# EAGLE design SNES-1Chip_MR_QID (EAGLE 7.5.0)
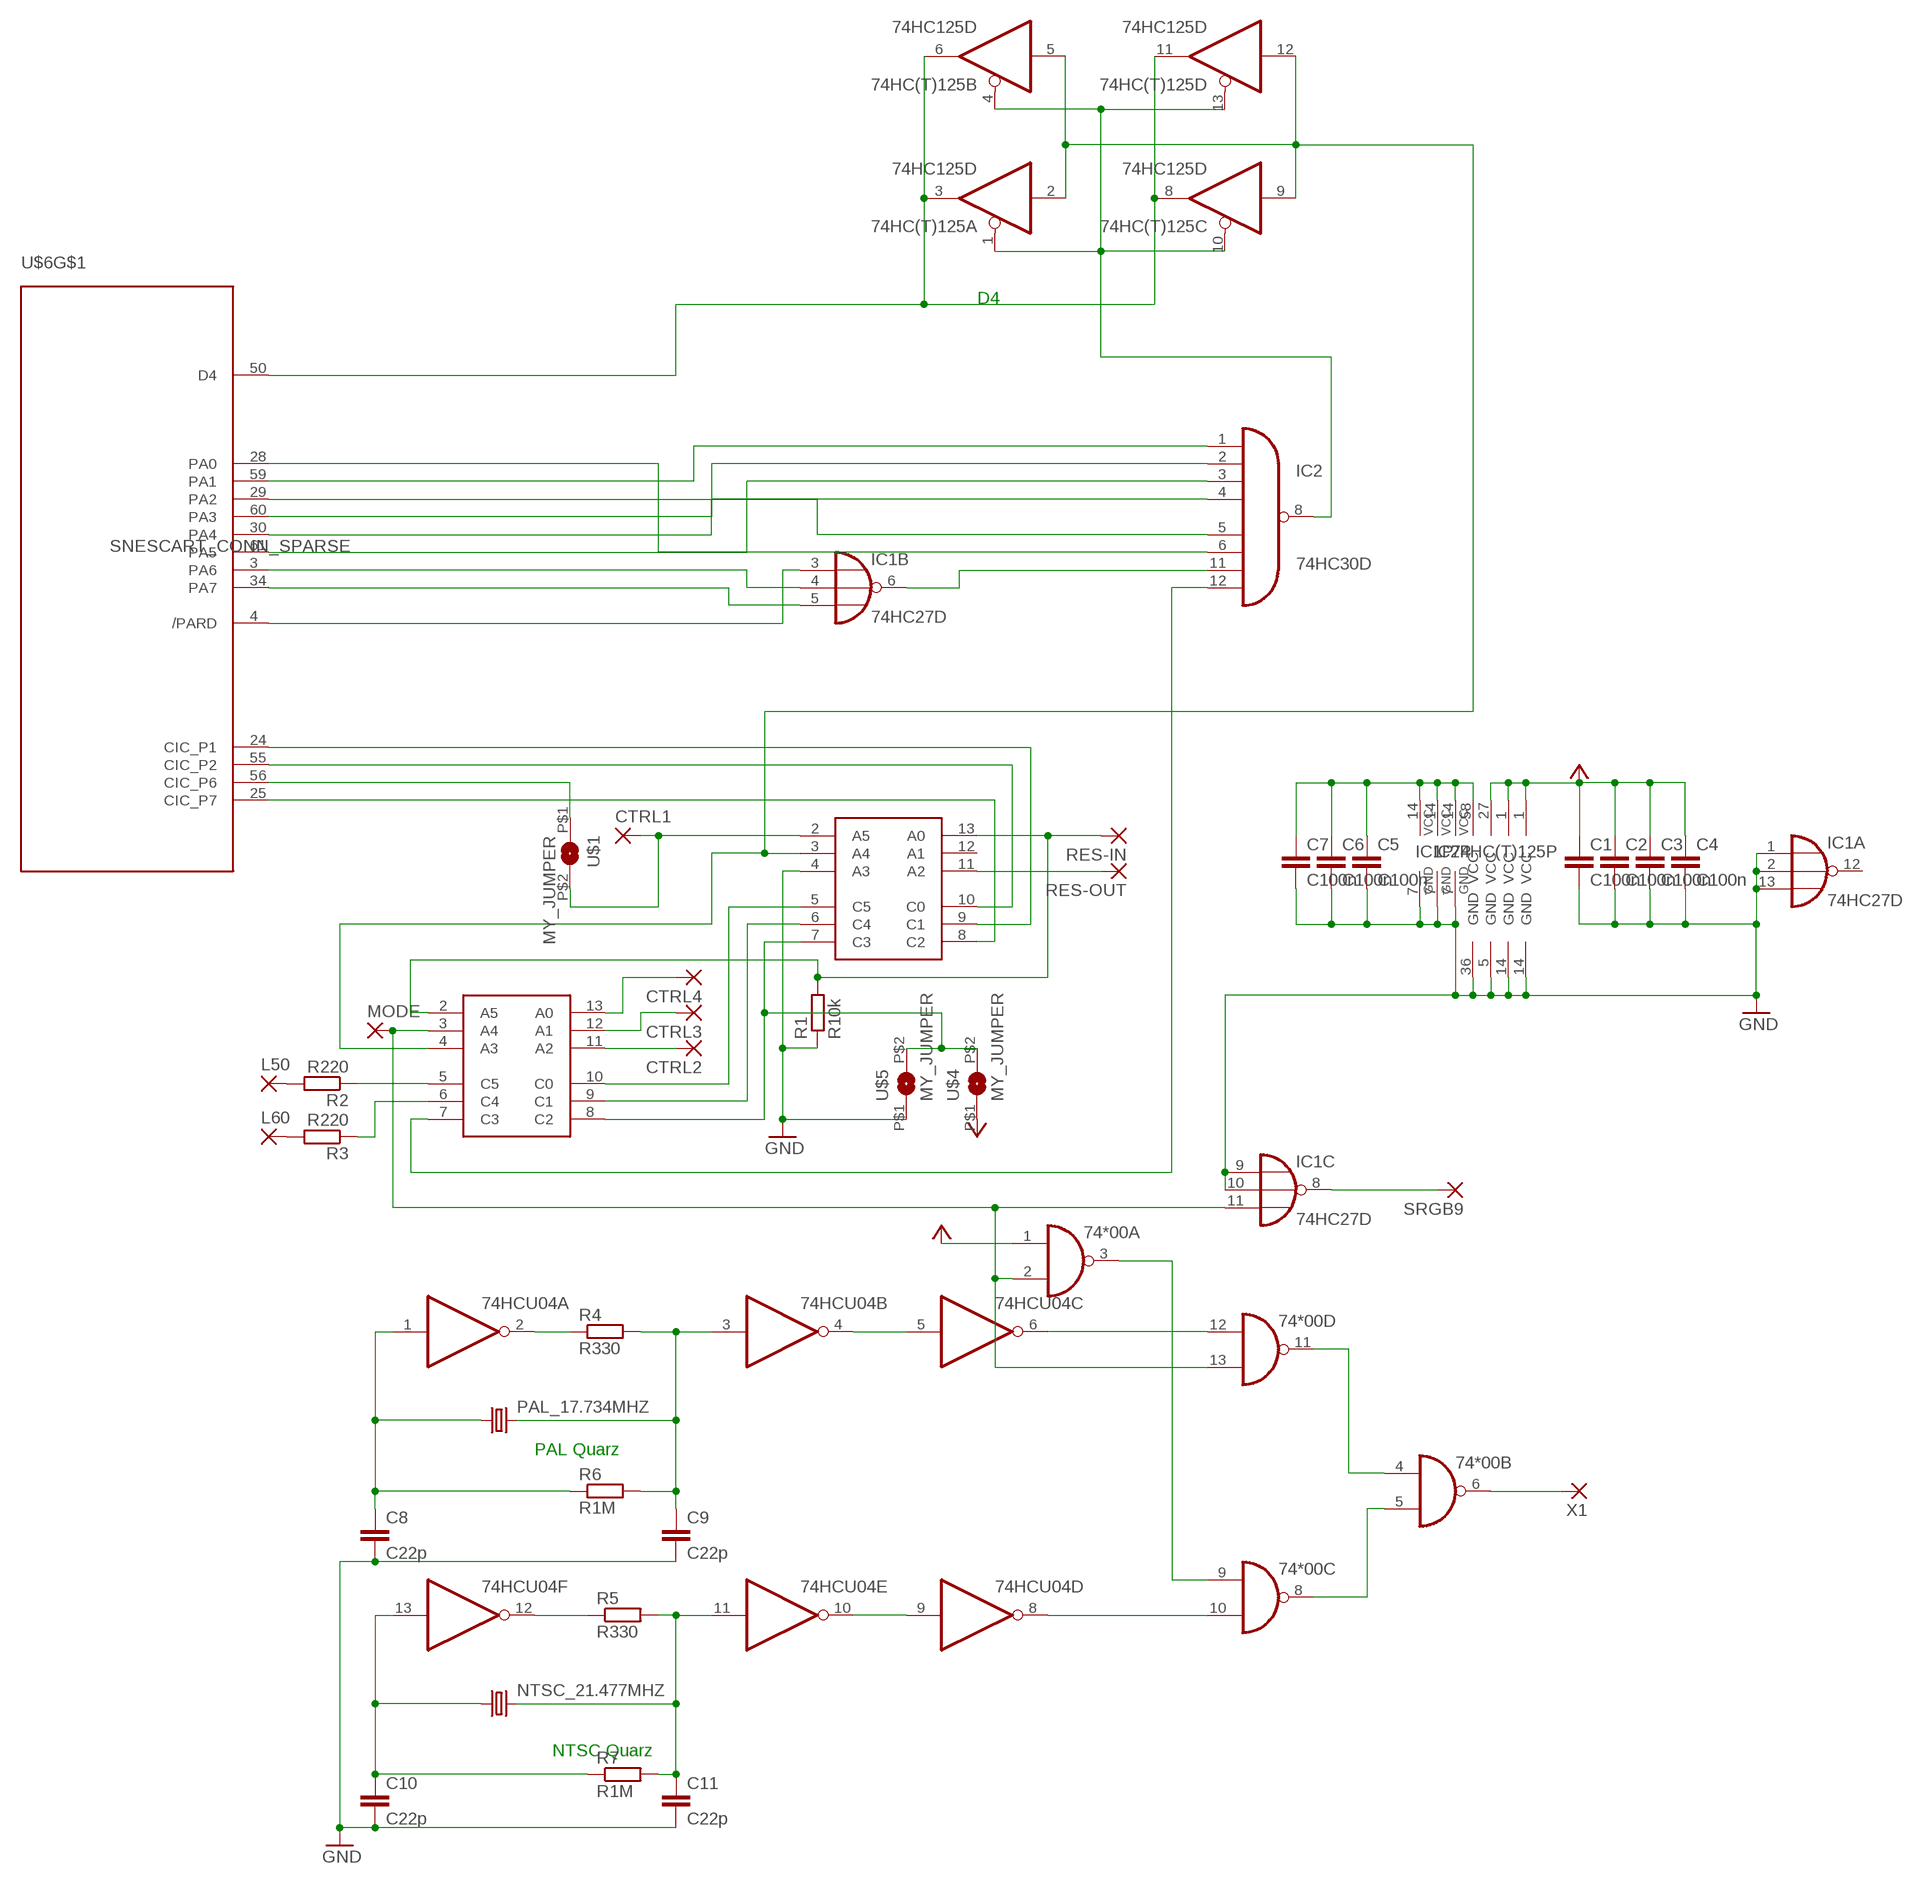
[diagram p0: schematic, sheet 1]

## Parts
74*00  7400D  [SO14]
74HC(T)125  74HC125D  [SO14]
74HCU04  74HC04D  [SO14]
C1  C100n  C0805  [Z0805]
C2  C100n  C0805  [Z0805]
C3  C100n  C0805  [Z0805]
C4  C100n  C0805  [Z0805]
C5  C100n  C0805  [Z0805]
C6  C100n  C0805  [Z0805]
C7  C100n  C0805  [Z0805]
C8  C22p  C0805  [Z0805]
C9  C22p  C0805  [Z0805]
C10  C22p  C0805  [Z0805]
C11  C22p  C0805  [Z0805]
CTRL1  SMD2  [SMD1,27-2,54]
CTRL2  SMD2  [SMD1,27-2,54]
CTRL3  SMD2  [SMD1,27-2,54]
CTRL4  SMD2  [SMD1,27-2,54]
IC1  74HC27D  [SO14]
IC2  74HC30D  [SO14]
L50  SMD2  [SMD1,27-2,54]
L60  SMD2  [SMD1,27-2,54]
MODE  SMD2  [SMD1,27-2,54]
NTSC_21.477MHZ  CRYSTALHC49UP  [HC49UP]
PAL_17.734MHZ  CRYSTALHC49UP  [HC49UP]
R1  R10k  R0805  [Z0805]
R2  R220  R0805  [Z0805]
R3  R220  R0805  [Z0805]
R4  R330  R0805  [Z0805]
R5  R330  R0805  [Z0805]
R6  R1M  R0805  [Z0805]
R7  R1M  R0805  [Z0805]
RES-IN  SMD2  [SMD1,27-2,54]
RES-OUT  SMD2  [SMD1,27-2,54]
SRGB9  SMD2  [SMD1,27-2,54]
U$1  MY_JUMPER  [MYJUMP]
U$2  PIC16F630_SIMPLE  [PIC16F630]
U$3  PIC16F630_SIMPLE  [PIC16F630]
U$4  MY_JUMPER  [MYJUMP]
U$5  MY_JUMPER  [MYJUMP]
U$6  SNESCART_CONN_SPARSE  [SNESCART_CONN_SPARSE]
X1  SMD2  [SMD1,27-2,54]

## Nets
GND: 74HC(T)125.7(P:GND) C1.2 C2.2 C3.2 C4.2 C5.2 C6.2 C7.2 C8.2 C9.2 C10.2 C11.2 IC1.1(A:I0) IC1.2(A:I1) IC1.7(P:GND) IC1.9(C:I0) IC1.10(C:I1) IC1.13(A:I2) IC2.7(GND) R1.1 U$2.4(A3) U$2.14(GND) U$3.14(GND) U$5.P$1 U$6.5(GND) U$6.36(GND)
N$1: IC1.8(C:O) SRGB9.1(P)
N$2: 74HC(T)125.1(A:OE) 74HC(T)125.4(B:OE) 74HC(T)125.10(C:OE) 74HC(T)125.13(D:OE) IC2.8(O)
N$3: RES-OUT.1(P) U$2.11(A2)
N$4: IC2.3(I2) U$6.61(PA5)
N$5: IC2.2(I1) U$6.60(PA3)
N$6: IC1.3(B:I0) U$6.4(/PARD)
N$7: IC1.4(B:I1) U$6.3(PA6)
N$8: IC1.6(B:O) IC2.11(I6)
N$9: IC2.6(I5) U$6.28(PA0)
N$10: R1.2 RES-IN.1(P) U$2.13(A0) U$3.2(A5)
N$11: L50.1(P) R2.2
N$12: R2.1 U$3.5(C5)
N$13: R3.1 U$3.6(C4)
N$14: 74*00.2(A:I1) 74*00.13(D:I1) IC1.11(C:I2) MODE.1(P) U$3.3(A4)
N$15: L60.1(P) R3.2
N$16: IC1.5(B:I2) U$6.34(PA7)
N$17: IC2.12(I7) U$3.7(C3)
N$18: U$1.P$1 U$6.56(CIC_P6)
N$19: U$2.5(C5) U$3.10(C0)
N$20: IC2.1(I0) U$6.59(PA1)
N$21: IC2.5(I4) U$6.29(PA2)
N$22: IC2.4(I3) U$6.30(PA4)
N$26: 74*00.12(D:I0) 74HCU04.6(C:O)
N$27: 74HCU04.1(A:I) C8.1 PAL_17.734MHZ.1 R6.1
N$28: 74HCU04.3(B:I) C9.1 PAL_17.734MHZ.2 R4.2 R6.2
N$29: 74HCU04.13(F:I) C10.1 NTSC_21.477MHZ.1 R7.1
N$30: 74HCU04.11(E:I) C11.1 NTSC_21.477MHZ.2 R5.2 R7.2
N$31: 74*00.5(B:I1) 74*00.8(C:O)
N$32: 74*00.4(B:I0) 74*00.11(D:O)
N$33: CTRL2.1(P) U$3.11(A2)
N$34: CTRL3.1(P) U$3.12(A1)
N$35: 74*00.3(A:O) 74*00.9(C:I0)
N$36: 74*00.6(B:O) X1.1(P)
N$37: 74HCU04.2(A:O) R4.1
N$38: 74HCU04.4(B:O) 74HCU04.5(C:I)
N$39: CTRL1.1(P) U$1.P$2 U$2.2(A5)
N$41: 74*00.10(C:I1) 74HCU04.8(D:O)
N$42: 74HC(T)125.3(A:O) 74HC(T)125.6(B:O) 74HC(T)125.8(C:O) 74HC(T)125.11(D:O) U$6.50(D4)
N$44: 74HCU04.9(D:I) 74HCU04.10(E:O)
N$46: CTRL4.1(P) U$3.13(A0)
N$48: U$2.10(C0) U$6.55(CIC_P2)
N$49: U$2.9(C1) U$6.24(CIC_P1)
N$50: 74HCU04.12(F:O) R5.1
N$51: U$2.8(C2) U$6.25(CIC_P7)
N$52: U$2.6(C4) U$3.9(C1)
N$53: U$2.7(C3) U$3.8(C2) U$4.P$2 U$5.P$2
UIGR: 74HC(T)125.2(A:I) 74HC(T)125.5(B:I) 74HC(T)125.9(C:I) 74HC(T)125.12(D:I) U$2.3(A4) U$3.4(A3)
VCC: 74*00.1(A:I0) C1.1 C2.1 C3.1 C4.1 U$2.1(VCC) U$3.1(VCC) U$4.P$1 U$6.27(VCC)
VCC_2: 74HC(T)125.14(P:VCC) C5.1 C6.1 C7.1 IC1.14(P:VCC) IC2.14(VCC) U$6.58(VCC)
Unconnected: IC1.12(A:O) U$2.12(A1)

## Notes on the sheet
- D4
- PAL Quarz
- NTSC Quarz

## Power pins joined to a net without a drawn wire
GND: 74*00.7(P:GND) 74HCU04.7(P:GND)
VCC: 74*00.14(P:VCC) 74HCU04.14(P:VCC)

## Library data of the parts
74*00 = 74xx-eu:74*00: Quad 2-input NAND gate
74HC(T)125 = 74xx-eu:74*125: Quad bus BUFFER, 3-state
74HCU04 = 74xx-eu:74*04: Hex INVERTER
C1-C11 = snescart:C0805
CTRL1-CTRL4 L50 L60 MODE RES-IN RES-OUT SRGB9 X1 = wirepad:SMD2: SMD PAD
IC1 = 74xx-eu:74*27: Triple 3-input NOR gate
IC2 = 74xx-eu:74*30: 8-input NAND gate
NTSC_21.477MHZ PAL_17.734MHZ = crystal:CRYSTAL: CRYSTAL; OC_FARNELL: unknown; OC_NEWARK: unknown
R1-R7 = snescart:R0805
U$1 U$4 U$5 = snescart:MY_JUMPER
U$2 U$3 = snescart:PIC16F630_SIMPLE
U$6 = snes_div:SNESCART_CONN_SPARSE

## Board
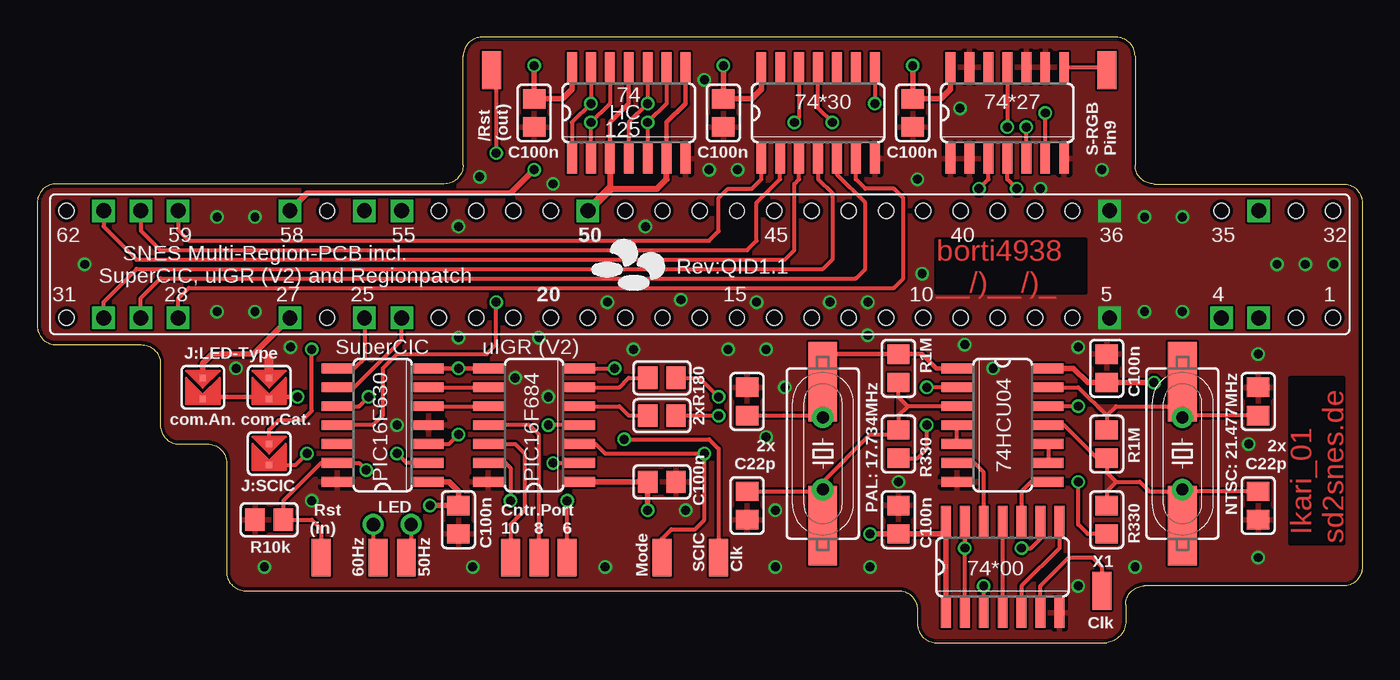
[diagram p1: board, top side]
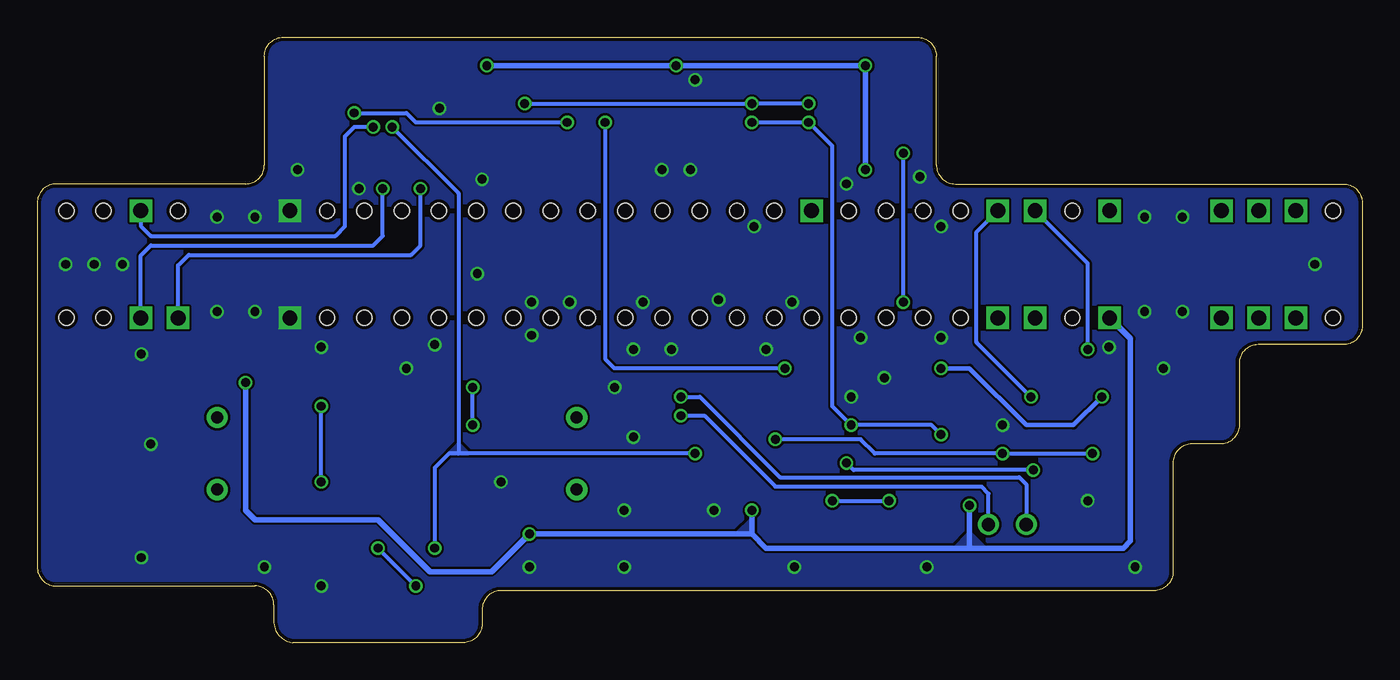
[diagram p2: board, bottom side, seen from below]

Size 88.9 x 40.64 mm. Coordinates in mm from the lower left corner, seen from the top.
Outline: 74.93,30.8 arc-90 73.66,32.07 73.66,39.37 arc90 72.39,40.64 29.84,40.64 arc90 28.57,39.37 28.57,32.07 arc-90 27.3,30.8 1.27,30.8 arc90 0,29.53 0,21.27 arc90 1.27,20 6.99,20 arc-90 8.26,18.73 8.26,14.61 arc90 9.53,13.34 11.43,13.34 arc-90 12.7,12.07 12.7,4.76 arc90 13.97,3.49 57.78,3.49 arc-90 59.05,2.22 59.05,1.27 arc90 60.32,0 71.76,0 arc90 73.03,1.59 73.03,2.54 arc-90 74.3,3.81 87.63,3.81 arc90 88.9,5.08 88.9,29.53 arc90 87.63,30.8 74.93,30.8
Copper layers (1*16): Top 0.035mm / dielectric 1.5mm / Bottom 0.035mm
Design rules "ITEADstudio_DRC": minimum track width 6mil, minimum drill 12mil, track to track 6mil, track to pad 6mil, pad to pad 6mil, via to via 6mil, smd to smd 0mil, copper to edge 10mil, drill to drill 10mil, minimum pad ring 10mil, minimum via ring 6mil, stop-mask expansion 2mil, vias tented up to drill 30mil, thermal gap 10mil
tRestrict: 3 lines

### Footprints (pad centres in the part's own frame; a part is rotated, then mirrored left to right if it is on the bottom)
SO14 = smd 0.66 x 2.032: 1 -3.81,-3.073; 2 -2.54,-3.073; 3 -1.27,-3.073; 4 0,-3.073; 5 1.27,-3.073; 6 2.54,-3.073; 7 3.81,-3.073; 8 3.81,3.073; 9 2.54,3.073; 10 1.27,3.073; 11 0,3.073; 12 -1.27,3.073; 13 -2.54,3.073; 14 -3.81,3.073
Z0805 = smd 1.3 x 1.5: 1 -0.95,0; 2 0.95,0
SMD1,27-2,54 = smd 1.27 x 2.54: 1 0,0
HC49UP = smd 5.334 x 1.93: 1 -4.826,0; 2 4.826,0
MYJUMP = smd 0.406 x 0.406: P$1 -0.635,0; P$2 0.765,0
PIC16F630 = smd 0.66 x 2.032: 1 -3.81,-3.073; 2 -2.54,-3.073; 3 -1.27,-3.073; 4 0,-3.073; 5 1.27,-3.073; 6 2.54,-3.073; 7 3.81,-3.073; 8 3.81,3.073; 9 2.54,3.073; 10 1.27,3.073; 11 0,3.073; 12 -1.27,3.073; 13 -2.54,3.073; 14 -3.81,3.073
SNESCART_CONN_SPARSE = drill 1 square: 3 -3.6,-37.5; 4 -3.6,-35; 5 -3.6,-27.5; 24 -3.6,20; 25 -3.6,22.5; 27 -3.6,27.5; 28 -3.6,35; 29 -3.6,37.5; 30 -3.6,40; 34 3.6,-37.5; 36 3.6,-27.5; 50 3.6,7.5; 55 3.6,20; 56 3.6,22.5; 58 3.6,27.5; 59 3.6,35; 60 3.6,37.5; 61 3.6,40 | hole 1: -3.6,-42.5; -3.6,-40; -3.6,-25; -3.6,-22.5; -3.6,-20; -3.6,-17.5; -3.6,-15; -3.6,-12.5; -3.6,-10; -3.6,-7.5; -3.6,-5; -3.6,-2.5; -3.6,0; -3.6,2.5; -3.6,5; -3.6,7.5; -3.6,10; -3.6,12.5; -3.6,15; -3.6,17.5; -3.6,25; -3.6,42.5; 3.6,42.5; 3.6,25; 3.6,17.5; 3.6,15; 3.6,12.5; 3.6,10; 3.6,5; 3.6,2.5; 3.6,0; 3.6,-2.5; 3.6,-5; 3.6,-7.5; 3.6,-10; 3.6,-12.5; 3.6,-15; 3.6,-17.5; 3.6,-20; 3.6,-22.5; 3.6,-25; 3.6,-35; 3.6,-40; 3.6,-42.5

### Placement (x,y rotation side)
74*00  64.77,5.08 0 top
74HC(T)125  39.69,35.56 0 top
74HCU04  64.77,14.61 270 top
C1  41.91,10.8 0 top
C2  28.26,8.25 270 top
C3  57.78,8.25 90 top
C4  71.76,18.41 90 top
C5  33.34,35.56 270 top
C6  46.04,35.56 270 top
C7  58.74,35.56 270 top
C8  47.62,16.19 90 top
C9  47.62,9.21 270 top
C10  81.92,16.19 90 top
C11  81.92,9.21 270 top
CTRL1  45.72,5.72 0 top
CTRL2  33.65,5.72 0 top
CTRL3  31.75,5.72 0 top
CTRL4  35.56,5.72 0 top
IC1  65.09,35.56 0 top
IC2  52.39,35.56 0 top
L50  24.77,5.72 0 top
L60  22.86,5.72 0 top
MODE  41.91,5.72 0 top
NTSC_21.477MHZ  76.84,12.7 270 top
PAL_17.734MHZ  52.7,12.7 270 top
R1  15.56,8.25 0 top
R2  41.91,15.24 0 top
R3  41.91,17.78 0 top
R4  57.78,13.34 90 top
R5  71.76,8.25 90 top
R6  57.78,18.41 270 top
R7  71.76,13.34 270 top
RES-IN  19.05,5.72 0 top
RES-OUT  30.48,38.42 180 top
SRGB9  71.76,38.42 0 top
U$1  15.56,12.7 270 top
U$2  23.18,14.61 90 top
U$3  33.34,14.61 90 top
U$4  11.11,17.14 270 top
U$5  15.56,17.14 270 top
U$6  44.45,25.4 90 top
X1  71.44,3.49 180 top

### Tracks (layer width: path | path; a pad name or v marks a point on that pad's centre or on a via)
GND  (via drill 0.6)
  Top 0.61: U$5.P$1 15.56,19.05
  other vias: 24.13,14.61 83.19,25.4 87,25.4 49.53,5.08 55.72,22.86 76.84,22.23 71.44,31.75 73.66,5.08 34.61,30.8 3.18,25.4 81.92,5.72 46.35,19.69 74.3,22.23 85.09,25.4 45.08,31.75 81.28,13.34 13.34,18.41 12.07,28.57 81.92,19.37 15.24,5.08 12.07,22.23 14.61,28.57 28.26,27.94 59.05,31.12 40,19.69 74.3,28.57 43.18,23.02 50.16,17.14 34.29,16.51 32.07,17.78 57.78,10.8 46.99,31.75 55.88,5.08 62.23,20 64.14,18.41 55.72,20.64 69.85,19.84 16.99,19.84 38.1,5.08 76.84,28.57 14.61,22.23 48.89,19.69 59.37,24.77 43.5,8.89 67.31,30.48 61.91,35.88 44.77,37.78 53.18,22.86 48.26,22.86 18.41,9.52 29.21,5.08 69.85,3.81 29.69,31.27 38.26,22.86 40.8,27.94 28.26,20.48 33.65,20.48 48.89,13.81 49.53,8.89
  pour Top (rank 2): -1.27,-2.54 90.17,-2.54 90.17,43.18 -1.27,43.18
  pour Bottom (rank 2): -1.27,43.18 90.17,43.18 90.17,-2.54 -1.27,-2.54
  pour Bottom (rank 2, no thermals): 69.85,30.48 73.66,30.48 73.66,20.48 69.85,20.48
  pour Top (rank 2, no thermals): 69.85,30.48 73.66,30.48 73.66,20.64 69.85,20.64
N$1
  Top 0.254: IC1.8 71.22,38.63 SRGB9.1
N$2  (via drill 0.6)
  Top 0.254: 74HC(T)125.13 v37.15,36.2 35.88,34.93 74HC(T)125.1 | 74HC(T)125.10 v40.96,36.2 39.69,34.93 74HC(T)125.4 | IC2.8 v56.2,36.2
  Bottom 0.254: v37.15,36.2 v40.96,36.2 v56.2,36.2
N$3  (via drill 0.6)
  Top 0.254: v30.8,22.86 30.8,20 30.16,19.37 24.13,19.37 23.18,18.41 23.18,15.24 22.54,14.61 U$2.11 | RES-OUT.1 30.8,38.1 v30.8,32.86
  Bottom 0.254: v30.8,22.86 v30.8,32.86
N$4
  Top 0.254: U$6.61 4.45,27.94 6.67,25.72 50.16,25.72 50.8,26.35 50.8,30.8 51.12,31.12 IC2.3
  Top 0.305: U$6.61
N$5
  Top 0.254: U$6.60 6.95,27.66 8.26,26.35 47.62,26.35 48.26,26.99 48.26,29.53 49.85,31.12 IC2.2
N$6  (via drill 0.6)
  Top 0.254: v63.18,30.48 63.82,31.12 IC1.3
  Bottom 0.254: U$6.4 79.45,25.32 78.74,26.04 63.82,26.04 63.18,26.67 v63.18,30.48
N$7  (via drill 0.6)
  Top 0.254: v65.72,30.48 65.09,31.12 IC1.4
  Bottom 0.254: U$6.3 81.95,26 81.28,26.67 66.36,26.67 65.72,27.3 v65.72,30.48
N$8  (via drill 0.6)
  Top 0.254: v53.34,34.93 52.39,35.88 IC2.11 | IC1.6 v67.63,35.56
  Bottom 0.254: v67.63,35.56 64.14,35.56 63.5,34.93 v53.34,34.93
N$9
  Top 0.254: U$6.28 9.45,23.1 10.16,23.81 57.47,23.81 58.1,24.45 58.1,29.84 57.47,30.48 55.56,30.48 54.93,31.12 IC2.6
N$10  (via drill 0.6)
  Top 0.254: RES-IN.1 19.05,7.62 18.41,8.25 R1.2 16.51,9.52 19.05,12.07 U$2.13 21.59,12.07 v22.07,11.59 | v34.61,12.07 U$3.2
  Bottom 0.254: v22.07,11.59 34.13,11.59 v34.61,12.07
N$11  (via drill 0.6, 0.9 pad 1.42)
  Top 0.254: R2.2 v45.72,15.24 | v25.08,7.94 25.08,6.03 L50.1
  Bottom 0.254: v45.72,15.24 44.13,15.24 39.37,10.48 25.56,10.48 25.08,10 v25.08,7.94
N$12
  Top 0.254: U$3.5 39.05,15.88 39.69,15.24 R2.1
N$13
  Top 0.254: U$3.6 39.05,17.14 39.69,17.78 R3.1
N$14  (via drill 0.6)
  Top 0.254: 74*00.2 74*00.13 v62.23,6.35 | U$3.3 37.46,13.34 38.1,12.7 v44.77,12.7 44.77,8.25 44.13,7.62 42.54,7.62 41.91,6.99 MODE.1 | IC1.11 v65.09,34.61
  Bottom 0.254: v44.77,12.7 60.64,12.7 | v65.09,34.61 60.64,30.16 60.64,12.7 | 60.64,12.7 61.28,12.7 62.23,11.75 v62.23,6.35
  pour Bottom: 61.28,12.7 60.01,12.7 60.64,13.34
N$15  (via drill 0.6, 0.9 pad 1.42)
  Top 0.254: R3.2 44.45,17.78 v45.72,16.51 | v22.54,7.94 22.54,6.03 L60.1
  Bottom 0.254: v45.72,16.51 44.45,16.51 39.05,11.11 23.02,11.11 22.54,10.64 v22.54,7.94
N$16  (via drill 0.6)
  Top 0.254: IC1.5 v66.36,34.61
  Bottom 0.254: v66.36,34.61 67.63,34.61 68.26,33.97 68.26,27.94 68.9,27.3 81.28,27.3 81.95,27.98 U$6.34
N$17  (via drill 0.6)
  Top 0.254: U$3.7 v38.73,18.41 | IC2.12 51.12,35.24 v50.8,34.93
  Bottom 0.254: v38.73,18.41 50.16,18.41 50.8,19.05 v50.8,34.93
N$18  (via drill 0.6)
  Top 0.254: U$1.P$1 15.56,14.29 16.19,14.92 17.78,14.92 18.41,15.56 v18.41,19.69
  Bottom 0.254: v18.41,19.69 18.41,25.46 U$6.56
N$19
  Top 0.254: U$2.5 U$3.10
N$20
  Top 0.254: U$6.59 9.45,27.7 10.16,26.99 45.08,26.99 45.72,27.62 45.72,29.84 46.35,30.48 47.94,30.48 48.58,31.12 IC2.1
N$21
  Top 0.254: U$6.29 6.95,23.14 8.26,24.45 54.93,24.45 55.56,25.08 55.56,29.53 53.66,31.43 IC2.5
N$22
  Top 0.254: U$6.30 4.45,22.87 6.67,25.08 52.7,25.08 53.34,25.72 53.34,30.16 52.39,31.12 IC2.4
N$26
  Top 0.254: 74*00.12 63.5,11.43 62.87,12.07 74HCU04.6
N$27  (via drill 0.8 pad 1.42)
  Top 0.254: PAL_17.734MHZ.1 v52.7,15.12 52.7,15.24 C8.1
  Top 0.305: 74HCU04.1 60.32,18.41 59.37,19.37 R6.1 52.71,19.37 52.7,19.37 PAL_17.734MHZ.1
N$28  (via drill 0.8 pad 1.42)
  Top 0.254: 74HCU04.3 58.42,15.88 | 58.42,15.88 57.78,16.51 R6.2 | 58.42,15.88 57.78,15.24 R4.2 57.47,13.97 55.88,13.97 52.7,10.8 v52.7,10.28 52.7,10.16 | C9.1 52.7,10.16 | 52.7,10.16 PAL_17.734MHZ.2
  pour Top: 57.78,15.24 57.78,16.51 58.42,15.88
N$29  (via drill 0.8 pad 1.42)
  Top 0.254: 74HCU04.13 69.85,17.14 71.76,15.24 | 71.76,15.24 R7.1 | 71.76,15.24 72.39,15.88 76.84,15.88 | NTSC_21.477MHZ.1 76.84,15.88 | 76.84,15.88 v76.84,15.12 76.84,15.24 C10.1
  pour Top: 72.39,15.88 71.12,15.88 71.76,15.24
N$30  (via drill 0.8 pad 1.42)
  Top 0.254: 72.39,10.8 71.76,11.43 R7.2 71.12,12.38 68.9,14.61 74HCU04.11 | 72.39,10.8 71.76,10.16 R5.2 | 77.47,10.16 76.83,10.16 74.61,10.16 73.98,10.8 72.39,10.8 | NTSC_21.477MHZ.2 76.84,9.52 77.47,10.16 | C11.1 77.47,10.16 | v76.84,10.28 77.47,10.16
  pour Top: 71.76,10.16 71.76,11.43 72.39,10.8
N$31
  Top 0.254: 74*00.8 68.58,6.35 66.04,3.81 74*00.5
N$32
  Top 0.254: 74*00.11 74*00.4
N$33
  Top 0.254: CTRL2.1 33.65,13.97 33.02,14.61 U$3.11
N$34
  Top 0.254: U$3.12 32.07,13.34 32.7,12.7 32.7,8.89 31.75,7.94 CTRL3.1
N$35  (via drill 0.6)
  Top 0.254: 74*00.3 v63.5,3.81 | v66.04,6.35 66.67,6.35 67.31,6.99 74*00.9
  Bottom 0.254: v63.5,3.81 v66.04,6.35
N$36
  Top 0.254: 74*00.6 67.31,3.81 69.22,5.72 70.8,5.72 71.44,5.08 X1.1
N$37  (via drill 0.6)
  Top 0.254: R4.1 59.06,12.39 59.69,13.02 v59.69,14.61 | 74HCU04.2 v59.69,17.14
  Bottom 0.254: v59.69,14.61 v59.69,17.14
N$38
  Top 0.254: 74HCU04.5 74HCU04.4
N$39  (via drill 0.6)
  Top 0.254: U$2.2 24.77,12.07 v24.13,12.7 | U$1.P$2 17.33,11.93 v18.1,12.7 | v39.37,13.65 45.08,13.65 45.72,13.02 CTRL1.1
  Bottom 0.254: v18.1,12.7 v24.13,12.7 32.7,12.7 33.65,13.65 v39.37,13.65
N$41
  Top 0.254: 74*00.10 66.04,10.16 66.67,10.8 74HCU04.8
N$42
  Top 0.305: 74HC(T)125.3 38.42,34.93 39.69,36.2 74HC(T)125.11 | 74HC(T)125.6 42.23,34.93 43.5,36.2 74HC(T)125.8 43.5,38.42
  Top 0.406: 74HC(T)125.6 42.23,31.12 41.59,30.48 38.42,30.48 74HC(T)125.3
  Top 0.61: U$6.50 36.95,29.01 38.42,30.48
N$44
  Top 0.254: 74HCU04.10 74HCU04.9
N$46  (via drill 0.6)
  Top 0.254: U$3.13 31.43,12.07 31.75,11.75 v31.75,9.52 | CTRL4.1 v35.56,9.52
  Bottom 0.254: v35.56,9.52 v31.75,9.52
N$48  (via drill 0.6)
  Top 0.254: U$2.10 21.59,15.88 v22.23,16.51
  Bottom 0.254: U$6.55 25.88,27.57 25.88,20.16 v22.23,16.51
N$49
  Top 0.254: U$2.9 21.27,17.14 24.45,20.32 U$6.24
N$50  (via drill 0.6)
  Top 0.254: R5.1 70.48,7.31 69.85,7.94 v69.85,10.8 | v69.85,15.88 74HCU04.12
  Bottom 0.254: v69.85,10.8 v69.85,15.88
N$51
  Top 0.254: U$6.25 21.95,19.09 21.27,18.41 U$2.8
N$52
  Top 0.254: U$2.6 U$3.9
N$53  (via drill 0.6)
  Top 0.305: U$2.7 v28.26,18.41 U$3.8 | v17.46,16.51 15.88,16.51 15.75,16.38 U$5.P$2 15.43,16.51 11.43,16.51 11.3,16.38 U$4.P$2
  Bottom 0.305: v17.46,16.51 19.37,14.61 22.54,14.61 26.35,18.41 v28.26,18.41
UIGR  (via drill 0.6)
  Top 0.254: U$3.4 v34.29,14.61 | 74HC(T)125.9 42.23,36.2 v40.96,34.93 74HC(T)125.5 | 74HC(T)125.2 v37.15,34.93 38.42,36.2 74HC(T)125.12 | U$2.3 27.62,13.34 v28.26,13.97
  Bottom 0.254: v28.26,13.97 28.89,14.61 v34.29,14.61 35.56,15.88 35.56,33.34 v37.15,34.93 v40.96,34.93
VCC  (via drill 0.6)
  Top 0.305: C3.1 | 60.96,7.31 60.96,7.3 74*00.14 | C4.1
  Top 0.356: 74HCU04.14 69.53,18.41 70.48,17.46 C4.1 v74.93,17.46 | U$3.1 C1.1 v40.96,8.89 | U$2.1 27.62,10.8 28.26,10.16 C2.1 v26.36,9.2 v26.35,9.21 | v55.88,7.3 C3.1 | C3.1 60.96,7.31 | 74*00.1 60.96,7.3 | U$4.P$1 11.11,18.73 11.75,19.37 14.52,19.37 U$6.27
  Bottom 0.305: 40.96,8.57 v40.96,8.89
  Bottom 0.356: v74.93,17.46 74.93,8.89 74.3,8.25 66.04,8.25 62.55,4.76 58.42,4.76 v55.88,7.3 40.96,7.3 | U$6.27 15.56,20.41 15.56,6.83 16.03,6.35 26.35,6.35 | 26.35,6.35 40,6.35 40.96,7.3 | 40.96,8.57 40.96,7.3 | v26.35,9.21 26.35,6.35
  pour Bottom: 25.4,6.35 26.35,7.3 27.3,6.35
  pour Bottom: 40.96,7.3 41.91,7.3 40.96,8.25
VCC_2  (via drill 0.6)
  Top 0.305: U$6.58 16.95,29.02 | C7.1 | C5.1 | v33.34,38.73 | C6.1
  Top 0.356: 16.95,29.02 18.1,30.16 31.75,30.16 v33.34,31.75 | v58.74,38.73 C7.1 | IC1.14 61.28,37.15 60.64,36.51 C7.1 | IC2.14 48.58,37.15 47.94,36.51 C6.1 | 74HC(T)125.14 35.88,37.15 35.24,36.51 C5.1 v33.34,38.73 | C6.1 v46.04,38.73
  Bottom 0.356: v33.34,31.75 v33.34,38.73 v46.04,38.73 v58.74,38.73

### Text on the board
Top: borti4938 / __/)__/)_ | Ikari_01 / sd2snes.de
tNames: 74 / HC / 125 | 74*30 | 74*27 | /Rst / (out) | C100n | C100n | C100n | S-RGB / Pin9 | SNES Multi-Region-PCB incl. / SuperCIC, uIGR (V2) and Regionpatch | Rev:QID1.1 | J:LED-Type | SuperCIC | uIGR (V2) | NTSC: 21.477MHz | PAL: 17.734MHz | C100n | com.An. | com.Cat. | 2xR180 | 2x / C22p | 2x / C22p | J:SCIC | PIC16F630 | PIC16F684 | LED | Rst / (in) | Cntr.Port / 10 | 8 | 6 | C100n | C100n | X1 | 60Hz | 50Hz | Mode | SCIC | Clk | Clk
tStop: b | o | r | t | i | 4 | 9 | 3 | 8 | _ | _ | / | ) | _ | _ | / | ) | _ | e | d | 1 | . | 0 | s | _ | e | i | r | n | s | a | 2 | k | I | d | s